# EAGLE design solarpanel2 (EAGLE 7.6.0)
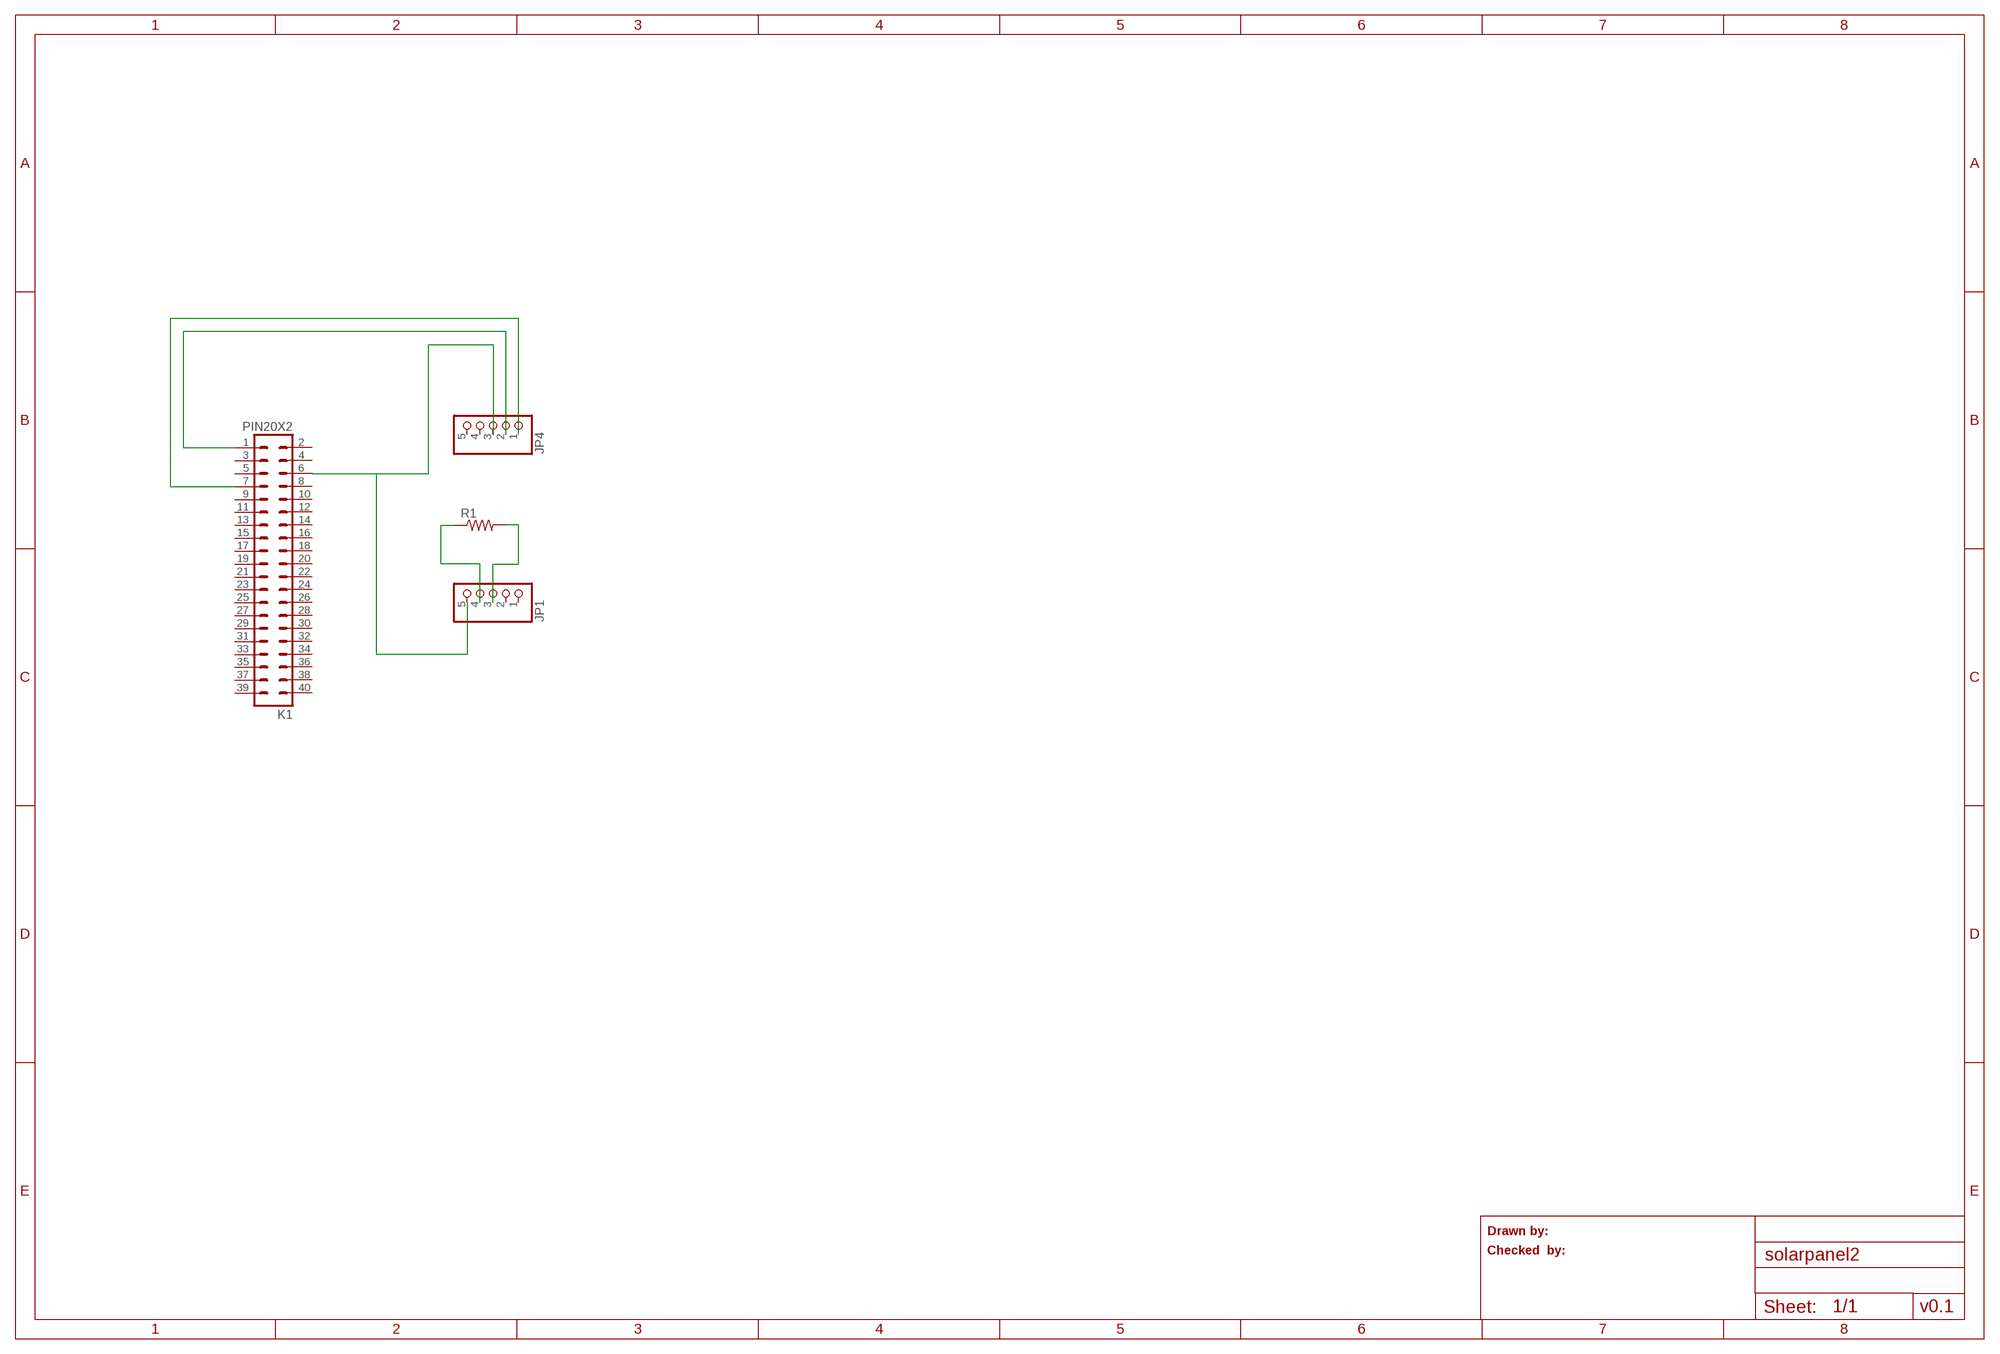
[diagram p0: schematic, sheet 1]

## Parts
JP1  PINHD-1X5  [1X05]
JP4  PINHD-1X5  [1X05]
K1  PIN20X2  [PIN_20X2]
R1  R-US_0207/10  [0207/10]

## Nets
N$2: JP4.1 K1.7
N$5: JP4.2 K1.1
N$6: JP1.5 JP4.3 K1.6
N$8: JP1.4 R1.1
N$9: JP1.3 R1.2
Unconnected: JP1.1 JP1.2 JP4.4 JP4.5 K1.2 K1.3 K1.4 K1.5 K1.8 K1.9 K1.10 K1.11 K1.12 K1.13 K1.14 K1.15 K1.16 K1.17 K1.18 K1.19 K1.20 K1.21 K1.22 K1.23 K1.24 K1.25 K1.26 K1.27 K1.28 K1.29 K1.30 K1.31 K1.32 K1.33 K1.34 K1.35 K1.36 K1.37 K1.38 K1.39 K1.40

## Notes on the sheet
- Drawn by:
- Checked  by:
- v0.1

## Library data of the parts
JP1 JP4 = pinhead:PINHD-1X5: PIN HEADER
K1 = FLYFISH:PIN20X2
R1 = resistor:R-US_: RESISTOR, American symbol

## Board
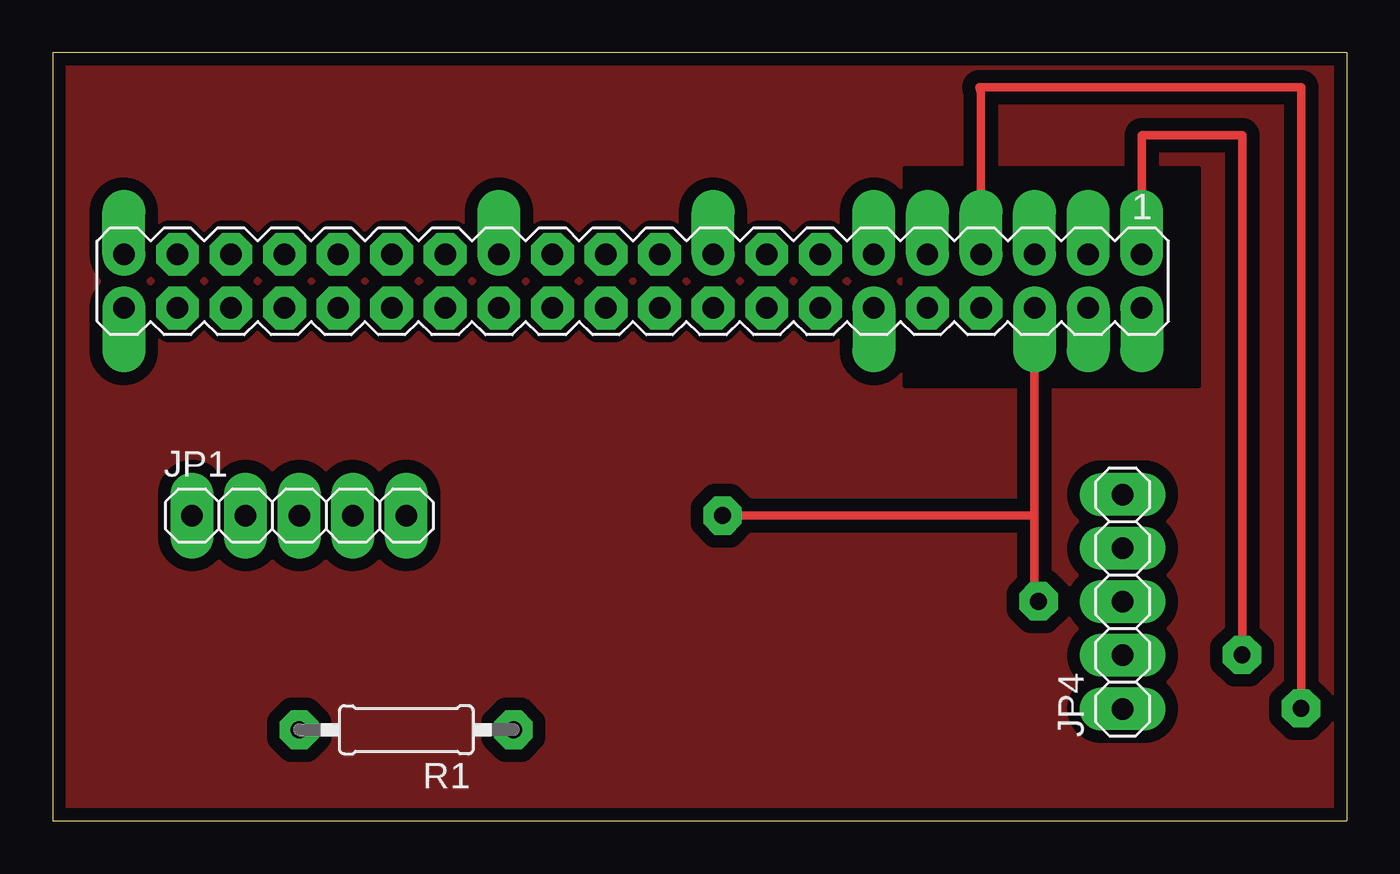
[diagram p1: board, top side]
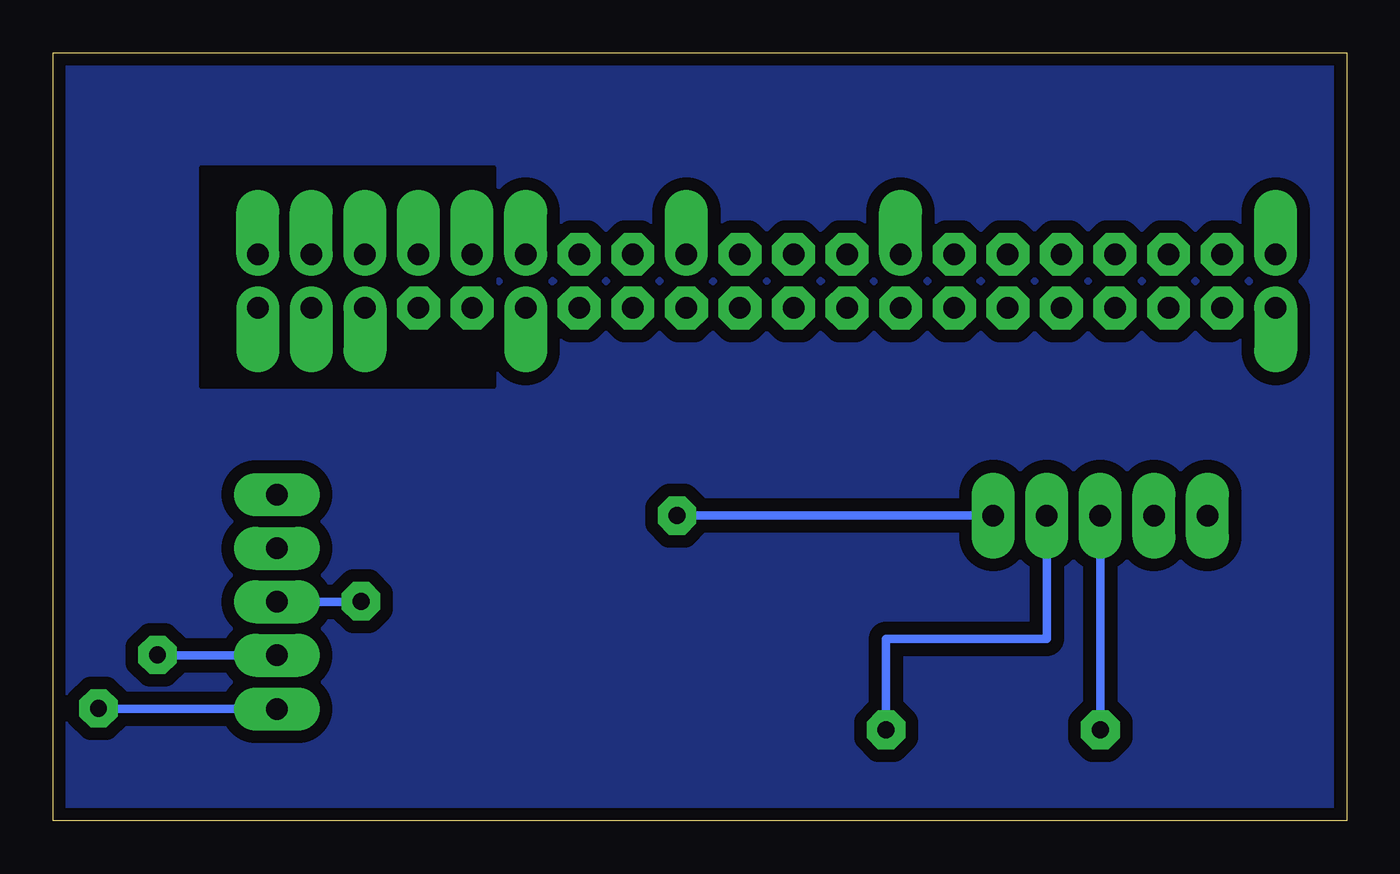
[diagram p2: board, bottom side, seen from below]

Size 61.35 x 36.43 mm. Coordinates in mm from the lower left corner, seen from the top.
Outline: 0,0 61.35,0 61.35,36.43 0,36.43 0,0
Copper layers (1*16): Top 0.035mm / dielectric 1.5mm / Bottom 0.035mm
Design rules "SparkFun *": minimum track width 16mil, minimum drill 0.799846875mm, track to track 8mil, track to pad 8mil, pad to pad 8mil, via to via 8mil, smd to smd 8mil, copper to edge 10mil, drill to drill 8mil, minimum pad ring 20mil, minimum via ring 20mil, stop-mask expansion 4mil, vias tented up to drill 25mil, thermal gap 10mil

### Footprints (pad centres in the part's own frame; a part is rotated, then mirrored left to right if it is on the bottom)
1X05 = drill 1.016 long: 1 -5.08,0; 2 -2.54,0; 3 0,0; 4 2.54,0; 5 5.08,0
PIN_20X2 = drill 1.016 offset: 1 -24.13,-1.27; 2 -24.13,1.27; 3 -21.59,-1.27; 4 -21.59,1.27; 5 -19.05,-1.27; 6 -19.05,1.27; 7 -16.51,-1.27; 9 -13.97,-1.27; 11 -11.43,-1.27; 12 -11.43,1.27; 17 -3.81,-1.27; 25 6.35,-1.27; 39 24.13,-1.27; 40 24.13,1.27 | drill 1.016 octagon: 8 -16.51,1.27; 10 -13.97,1.27; 13 -8.89,-1.27; 14 -8.89,1.27; 15 -6.35,-1.27; 16 -6.35,1.27; 18 -3.81,1.27; 19 -1.27,-1.27; 20 -1.27,1.27; 21 1.27,-1.27; 22 1.27,1.27; 23 3.81,-1.27; 24 3.81,1.27; 26 6.35,1.27; 27 8.89,-1.27; 28 8.89,1.27; 29 11.43,-1.27; 30 11.43,1.27; 31 13.97,-1.27; 32 13.97,1.27; 33 16.51,-1.27; 34 16.51,1.27; 35 19.05,-1.27; 36 19.05,1.27; 37 21.59,-1.27; 38 21.59,1.27
0207/10 = drill 0.813 octagon: 1 -5.08,0; 2 5.08,0

### Placement (x,y rotation side)
JP1  11.68,14.48 0 top
JP4  50.73,10.39 90 top
K1  27.5,25.59 180 top
R1  16.76,4.32 180 top

### Tracks (layer width: path | path; a pad name or v marks a point on that pad's centre or on a via)
N$1
  pour Bottom (isolate 0.61): 0,36.32 61.47,36.32 61.47,0 0,0
N$2  (via drill 0.8 pad 0.81)
  Top 0.406: v59.18,5.33 59.18,34.8 43.94,34.8 44.01,34.54 K1.7
  Bottom 0.406: JP4.1 59.18,5.31 v59.18,5.33
N$3
  pour Top (isolate 0.61): 0,36.32 61.47,36.32 61.47,0 0,0
N$4
  cutout Top (isolate 0.813): 40.39,30.99 54.36,30.99 54.36,20.57 40.39,20.57
  cutout Bottom (isolate 0.813): 40.39,30.99 54.36,30.99 54.36,20.57 40.39,20.57
N$5  (via drill 0.8 pad 0.81)
  Top 0.406: v56.39,7.87 56.39,32.51 51.63,32.51 K1.1
  Bottom 0.406: JP4.2 56.39,7.85 v56.39,7.87
N$6  (via drill 0.8 pad 0.81)
  Top 0.406: v46.74,10.41 46.55,10.41 46.55,14.48 | 46.55,14.48 K1.6 | v31.75,14.48 46.55,14.48
  Bottom 0.406: JP4.3 46.74,10.39 v46.74,10.41 | JP1.5 v31.75,14.48
N$8
  Bottom 0.406: JP1.4 14.22,8.64 21.84,8.64 R1.1
N$9
  Bottom 0.406: R1.2 JP1.3